# Altium schematic sheet 13_NB-IOT_Peripheral.SchDoc
size A3
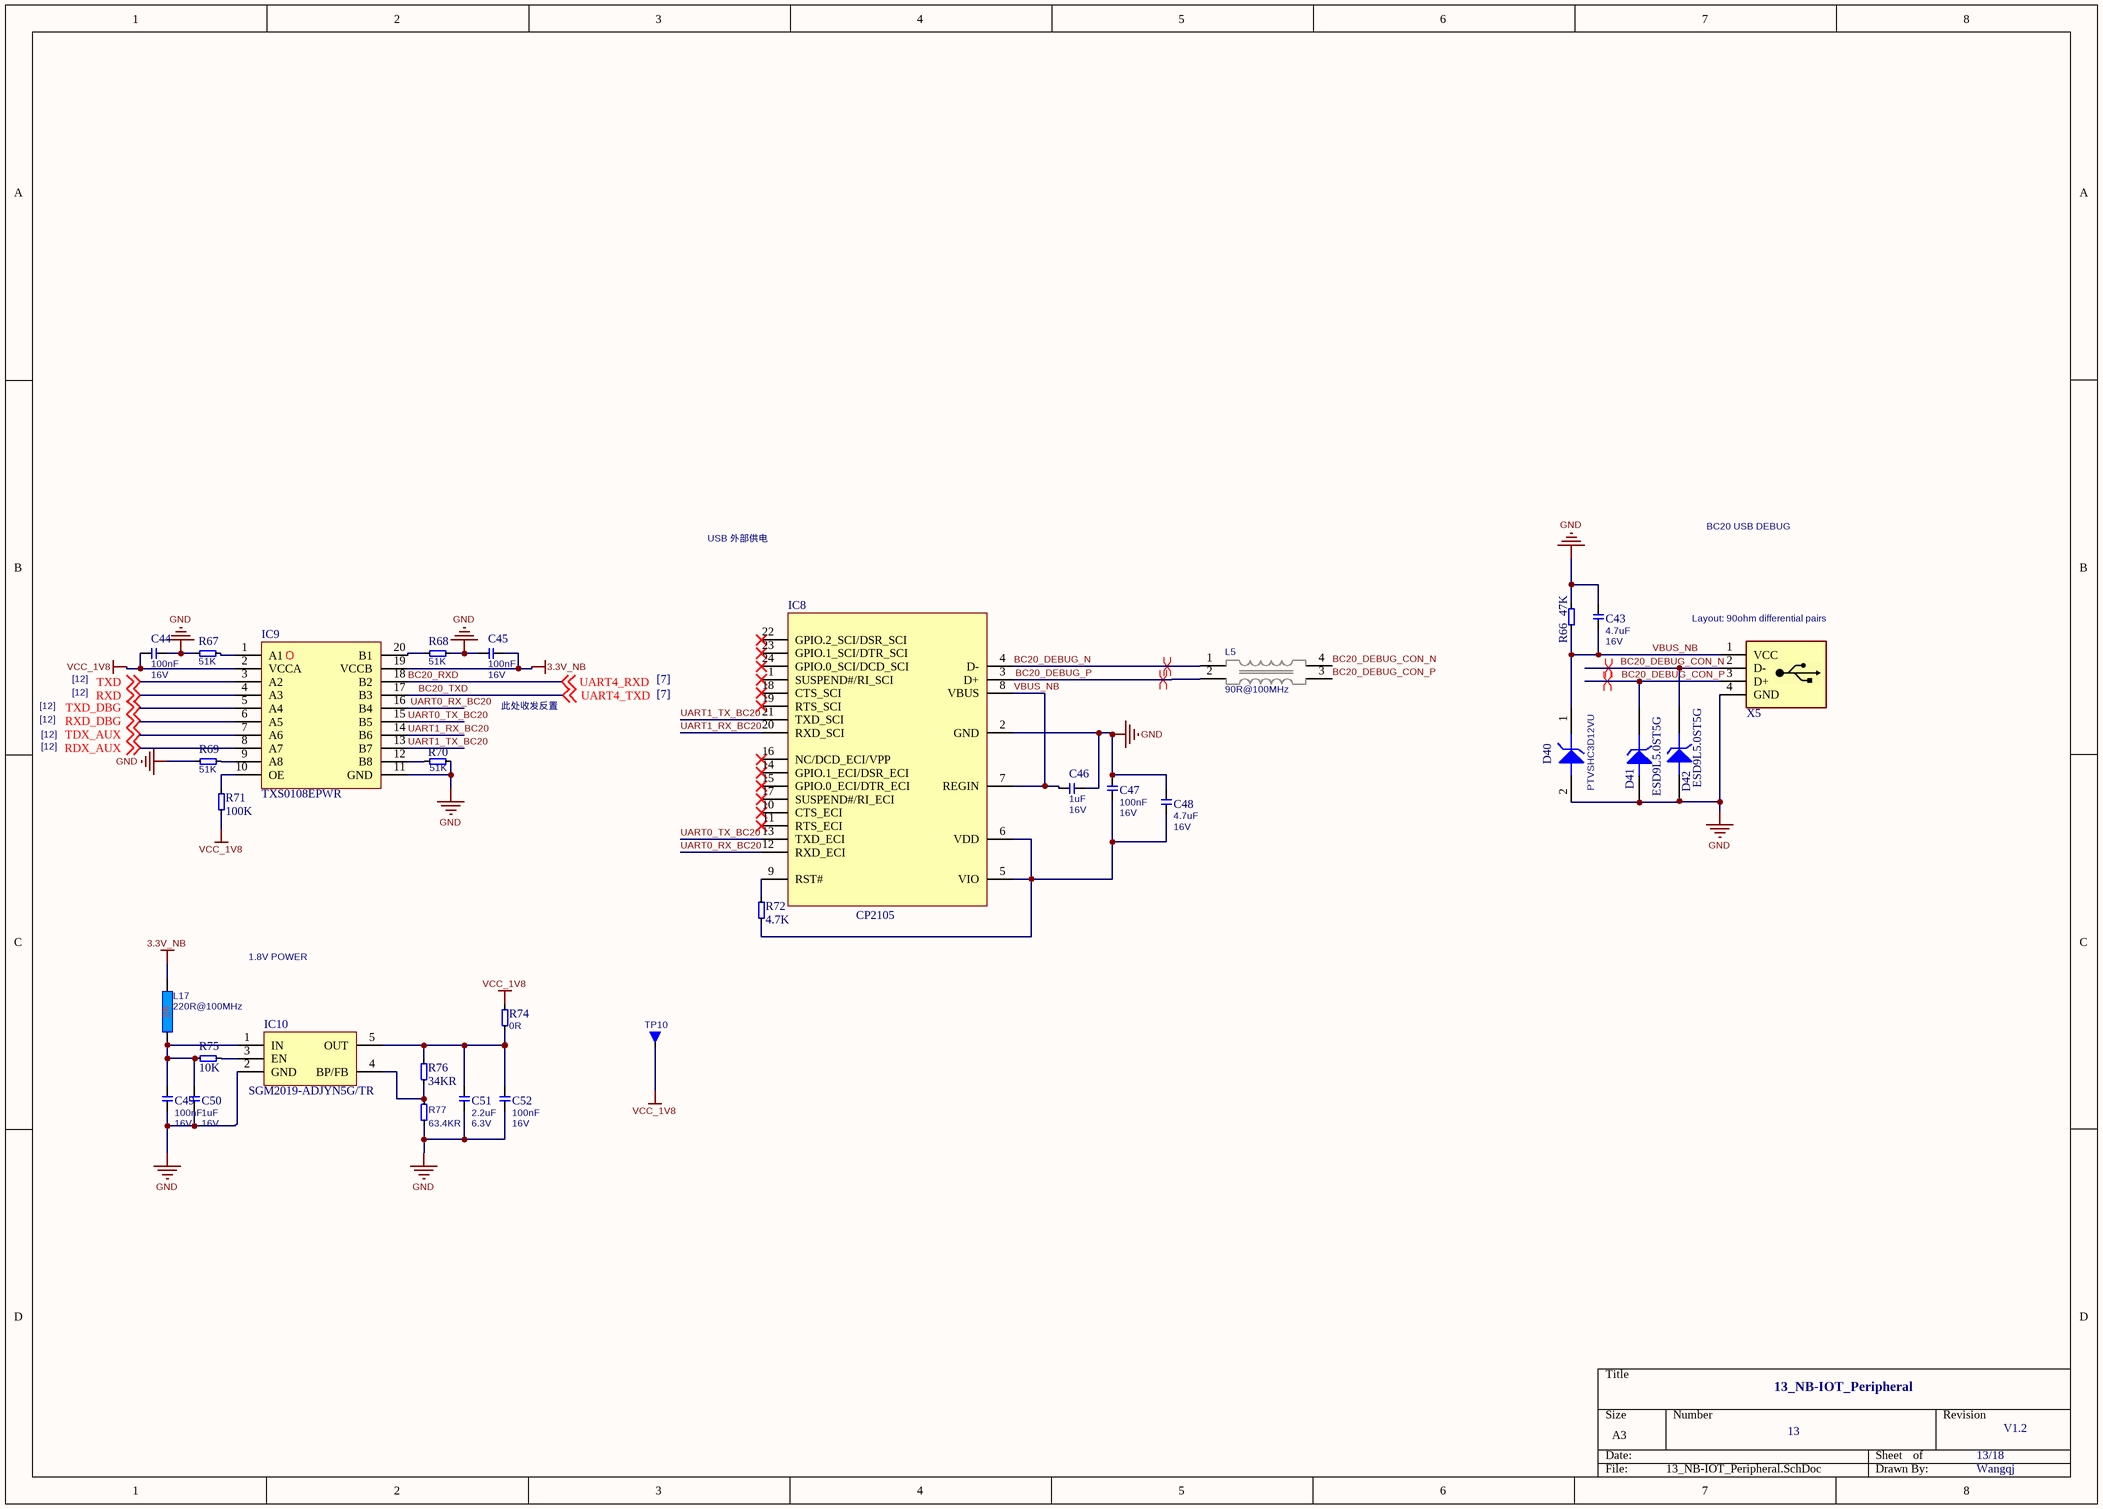
[diagram p0: 13_NB-IOT_Peripheral.SchDoc]

## Parts
C43  Rating: 16V  [T_CAPC0603X33N]  (hidden comment: 4.7uF)
C44  Rating: 16V  [T_CAPC0603X33N]  (hidden comment: 100nF)
C45  Rating: 16V  [T_CAPC0603X33N]  (hidden comment: 100nF)
C46  Rating: 16V  [T_CAPC0603X33N]  (hidden comment: 1uF)
C47  Rating: 16V  [T_CAPC0603X33N]  (hidden comment: 100nF)
C48  Rating: 16V  [T_CAPC0603X33N]  (hidden comment: 4.7uF)
C49  Rating: 16V  [T_CAPC0603X33N]  (hidden comment: 100nF)
C50  Rating: 16V  [T_CAPC0603X33N]  (hidden comment: 1uF)
C51  Rating: 6.3V  [T_CAPC0603X33N]  (hidden comment: 2.2uF)
C52  Rating: 16V  [T_CAPC0603X33N]  (hidden comment: 100nF)
D40  PTVSHC3D12VU  [LC-SOD-323]
D41  ESD9L5.0ST5G  [LC-SOD-923]
D42  ESD9L5.0ST5G  [LC-SOD-923]
IC8  CP2105  [LC-QFN-24_4x4x05P]
IC9  TXS0108EPWR  [LC-TSSOP-20]
IC10  SGM2019-ADJYN5G/TR  [LC-SOT-23-5]
L5  90R@100MHz  [T_Murata_DLW21SN900SQ2]
L17  220R@100MHz  [INDC1608X95N]
R66  47K  [T_RESC0603X30N]
R67  51K  [T_RESC0603X30N]
R68  51K  [T_RESC0603X30N]
R69  51K  [T_RESC0603X30N]
R70  51K  [T_RESC0603X30N]
R71  100K  [T_RESC0603X30N]
R72  4.7K  [t_RESC0603X30N]
R74  0R  [T_RESC0603X30N]
R75  10K  [T_RESC0603X30N]
R76  34KR  [T_RESC0603X30N]
R77  63.4KR  [T_RESC0603X30N]
TP10  Testpin  [T_TP-THT]  (value not drawn)
X5  CON-USB  [2.54*4p]  (value not drawn)

## Nets
3.3V_NB: C45.2 IC9.19(VCCB) L17.2
GND: C43.2 C44.2 C45.1 C46.2 C47.2 C48.2 C49.1 C50.1 C51.1 C52.1 D40.2(A) D41.1(A) D42.1(A) IC8.2(GND) IC9.11(GND) IC10.2(GND) R66.2 R67.1 R68.2 R69.1 R70.2 R77.1 X5.4(GND)
VCC_1V8: C44.1 IC9.2(VCCA) R71.1 R74.2 TP10.1
BC20_DEBUG_CON_N: D42.2(K) L5.4 X5.2(D-)
BC20_DEBUG_CON_P: D41.2(K) L5.3 X5.3(D+)
BC20_DEBUG_N: IC8.4(D-) L5.1
BC20_DEBUG_P: IC8.3(D+) L5.2
BC20_RXD: IC9.18(B2) ; off-sheet UART4_RXD  [also labelled UART4_RXD]
BC20_TXD: IC9.17(B3) ; off-sheet UART4_TXD  [also labelled UART4_TXD]
RDX_AUX: IC9.8(A7) ; off-sheet RDX_AUX
RXD: IC9.4(A3) ; off-sheet RXD
RXD_DBG: IC9.6(A5) ; off-sheet RXD_DBG
TDX_AUX: IC9.7(A6) ; off-sheet TDX_AUX
TXD: IC9.3(A2) ; off-sheet TXD
TXD_DBG: IC9.5(A4) ; off-sheet TXD_DBG
UART0_RX_BC20: IC8.12(RXD_ECI) IC9.16(B4)
UART0_TX_BC20: IC8.13(TXD_ECI) IC9.15(B5)
UART1_RX_BC20: IC8.20(RXD_SCI) IC9.14(B6)
UART1_TX_BC20: IC8.21(TXD_SCI) IC9.13(B7)
VBUS_NB: C43.1 C46.1 D40.1(K) IC8.7(REGIN) IC8.8(VBUS) R66.1 X5.1(VCC)
NetC47_1: C47.1 C48.1 IC8.5(VIO) IC8.6(VDD) R72.1
NetC49_2: C49.2 C50.2 IC10.1(IN) L17.1 R75.1
NetC51_2: C51.2 C52.2 IC10.5(OUT) R74.1 R76.2
NetIC8_9: IC8.9(RST#) R72.2
NetIC9_1: IC9.1(A1) R67.2
NetIC9_9: IC9.9(A8) R69.2
NetIC9_10: IC9.10(OE) R71.2
NetIC9_12: IC9.12(B8) R70.1
NetIC9_20: IC9.20(B1) R68.1
NetIC10_3: IC10.3(EN) R75.2
NetIC10_4: IC10.4(BP/FB) R76.1 R77.2

Not connected (* = marked no-connect by the designer): IC8 1(SUSPEND#/RI_SCI)* 10(CTS_ECI)* 11(RTS_ECI)* 14(GPIO.1_ECI/DSR_ECI)* 15(GPIO.0_ECI/DTR_ECI)* 16(NC/DCD_ECI/VPP)* 17(SUSPEND#/RI_ECI)* 18(CTS_SCI)* 19(RTS_SCI)* 22(GPIO.2_SCI/DSR_SCI)* 23(GPIO.1_SCI/DTR_SCI)* 24(GPIO.0_SCI/DCD_SCI)*

## Layout directives
differential pair: BC20_DEBUG_CON_N, BC20_DEBUG_CON_P, BC20_DEBUG_N, BC20_DEBUG_P

## Notes on the sheet
- USB 外部供电
- BC20 USB DEBUG
- (near X5) Layout: 90ohm differential pairs
- [12]
- 此处收发反置
- [7]
- 1.8V POWER
- 13_NB-IOT_Peripheral
- 13
- 13/18
- V1.2
- Wangqj

## Library data of the parts
C43 C48 = C-4.7uF-16V-10%-0603-X5R: Capacitor Ceramic X5R 4.7uF 16V 10% 0603; Tolerance: 10%; Type: X5R; Value: 4.7uF
C44 C45 C49 C52 = C-X7R-100nF-16V-10%-0603: Capacitor Ceramic X7R 100nF 16V 10% 0603; Tolerance: 10%; Type: X7R; Value: 100nF
C46 = C-1uF-16V-10%-0603-X5R: Capacitor Ceramic X5R 1uF 16V 10% 0603; Tolerance: 10%; Type: X5R; Value: 1uF
C47 = C-100nF-16V-10%-0603-X7R: Capacitor Ceramic X7R 100nF 16V 10% 0603; Tolerance: 10%; Type: X7R; Value: 100nF
C50 = C-X5R-1uF-16V-10%-0603: Capacitor Ceramic X5R 1uF 16V 10% 0603; Tolerance: 10%; Type: X5R; Value: 1uF
C51 = C-X5R-2.2uF-6.3V-20%-0603: Capacitor Ceramic X5R 2.2uF 6.3V 20% 0603; Tolerance: 20%; Type: X5R; Value: 2.2uF
D40 = Diode_TVS: TVS Diode
D41 D42 = ZENER3: TVS Diode
IC8 = IC-SILICON-CP2105: Single-Chip USB To Dual UART Bridge; Manufacturer Name: SILICON LABS; Manucfacturer Part NO.: CP2105
IC9 = IC-TI-TXS0108EPWR: 8-Bit Bidirectional Voltage-level Translator; Manufacturer Name: Texas Instruments; Manufacturer Part No.: TXS0108EPWR
IC10 = IC-SGMICRO-SGM2019: LDO Input: 2.5V to 5.5V Output:1.2V to 5V; Manufacturer Name: SGMICRO; Manufacturer Part No.: SGM2019-ADJYN5G/TR
L5 = L-Murata-DLW21SN900SQ2-90R@100MHz-330mA-25%: Common Mode Choke High Speed 90R 330mA; Manufacturer Name: Murata; Tolerance: 25%; Rating: 330mA; Manufacturer Part No.: DLW21SN900SQ2; Value: 90R@100MHz
L17 = L-220R@100MHz-2A-25%-0603: 220R@100MHz 2A EMI FILTER; Tolerance: 25%; Rating: 2A; Value: 220R@100MHz
R66 = R-47KR-63mW-5%-0603: Resistor 47 Kohm 63mW 5% 0603; Value: 47KR; Rating: 63mW; Tolerance: 5%
R67-R70 = R-51K-5%-0603: Resistor 51K ohm  5% 0603; Rating: 63mW; Tolerance: 5%; Value: 51K
R71 = R-100KR-63mW-5%-0603: Resistor 100 Kohm 63mW 5% 0603; Value: 100KR; Rating: 63mW; Tolerance: 5%
R72 = R-4.7kR-63mW-5%-0603: Resistor 4.7 Kohm 63mW 5% 0603; Value: 4.7KR; Rating: 63mW; Tolerance: 5%
R74 = R-0R-63mW-1%-0603: Resistor 0 ohm 63mW 1% 0603; Rating: 63mW; Tolerance: 1%; Value: 0R
R75 = R-10KR-63mW-5%-0603: Resistor 10 Kohm 63mW 5% 0603; Value: 10KR; Rating: 63mW; Tolerance: 5%
R76 = R-34KR-63mW-1%-0603: Resistor 34 Kohm 63mW 1% 0603; Rating: 63mW; Tolerance: 1%; Value: 34KR
R77 = R-63.4KR-1%-0603: Resistor 63.4 Kohm  1% 0603; Rating: 63mW; Tolerance: 1%; Value: 63.4KR
TP10 = Testpin: Testpin TH
X5 = CON-USB: USB  Connector; Manufacturer Name: FCI; Manufacturer Part No.: 73725-0110BLF; No. of ways: 4